# Altium project PCB_Project.PrjPcb
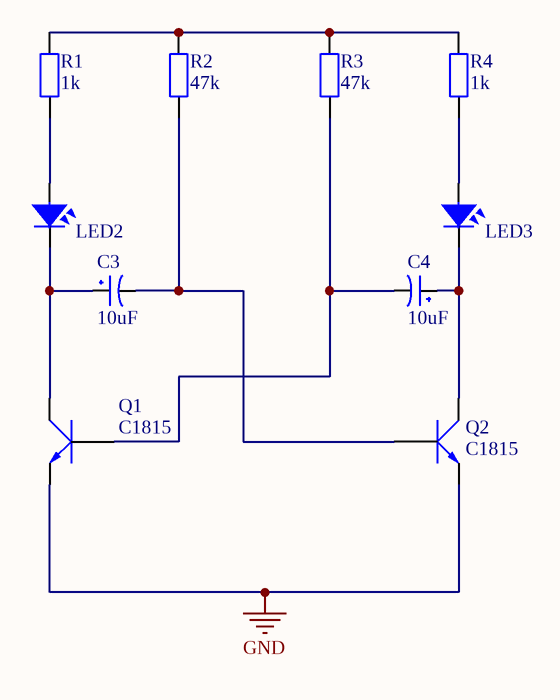
[diagram p0: bai 1.SchDoc]
1 sheet, 10 parts. Net scope: global (net labels, ports and power ports of the same name join across sheets).
Board file: bai 1.PcbDoc

## Sheet bai 1.SchDoc
size A0; SheetNumber: 1; SheetTotal: 1

### Parts
C3  10uF  [tu hoa 4mm]
C4  10uF  [tu hoa 4mm]
LED2  LED  [LED-3]  (value not drawn)
LED3  LED  [LED-3]  (value not drawn)
Q1  C1815  [TO92]
Q2  C1815  [TO92]
R1  1k  [tro vach 1/4w]
R2  47k  [tro vach 1/4w]
R3  47k  [tro vach 1/4w]
R4  1k  [tro vach 1/4w]

### Nets
GND: Q1.1(E) Q2.1(E)
NetC3_1: C3.1 LED2.2 Q1.2(C)
NetC3_2: C3.2 Q2.3(B) R2.1
NetC4_1: C4.1 LED3.2 Q2.2(C)
NetC4_2: C4.2 Q1.3(B) R3.1
NetLED2_1: LED2.1 R1.1
NetLED3_1: LED3.1 R4.1
NetR1_2: R1.2 R2.2 R3.2 R4.2

### Library data of the parts
C3 C4 = Tu Hoa 10uF 16V 4x7: Cắm; So_Chan: 2; Don_Vi: Con; Ten_Linh_Kien: Tụ Hóa 10uF 16V; Ma_Hang: MH006855; Chung_Loai: Cắm; Kieu_Chan: *
LED2 LED3 = LED: LED Single colour Green and Red; Value: LED 3 ly Single Colour
Q1 Q2 = C1815: NPN transistor; Value: C9014
R1-R4 = Tro Vach 1/4W 5% 2k: Cắm; Don_Vi: Con; So_Chan: 2; Ten_Linh_Kien: Trở Vạch 1/4w 5% 2k; Ma_Hang: MH007305; Chung_Loai: Cắm; Kieu_Chan: *